# EAGLE design googleShoes_rev05 (EAGLE 6.2)
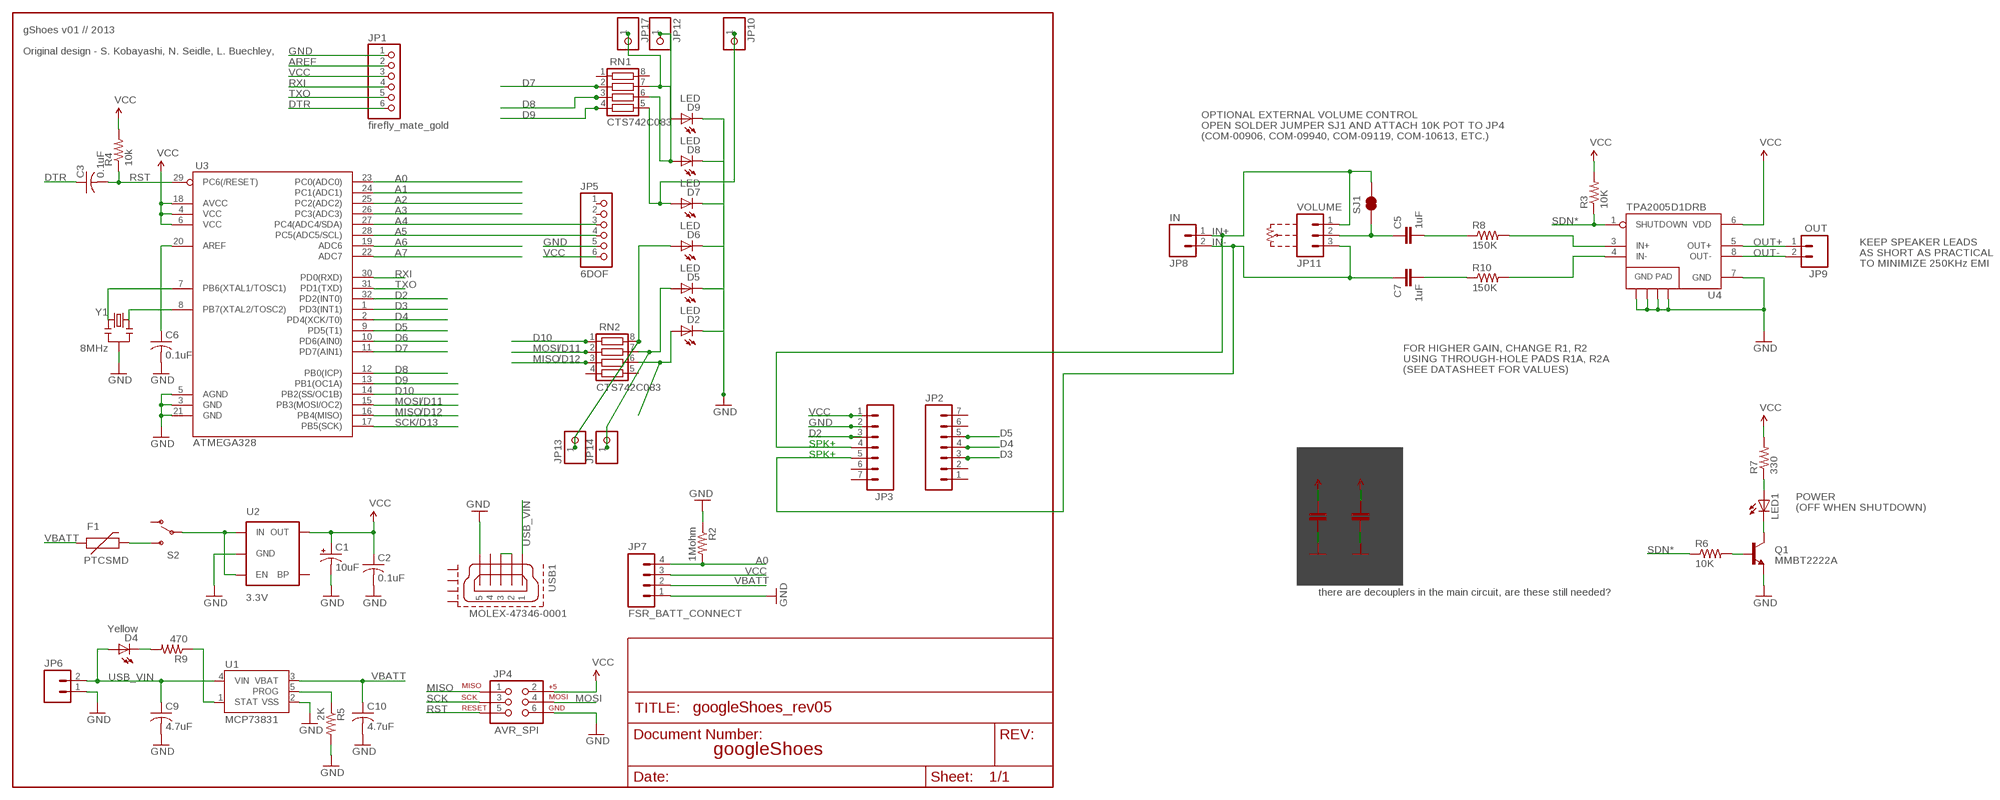
[diagram p0: schematic, sheet 1]

## Parts
C1  10uF  CAP_POL1206  [EIA3216]
C2  0.1uF  C-USC0805  [C0805]
C3  0.1uF  C-USC0805  [C0805]
C4  1uF  CAP1206  [1206]
C5  1uF  CAP1206  [1206]
C6  0.1uF  C-USC0805  [C0805]
C7  1uF  CAP1206  [1206]
C8  10uF  CAP1206  [1206]
C9  4.7uF  C-USC0805  [C0805]
C10  4.7uF  C-USC0805  [C0805]
D2  LED  LEDCHIP-LED0805  [CHIP-LED0805]
D4  Yellow  LEDCHIP-LED0805  [CHIP-LED0805]
D5  LED  LEDCHIP-LED0805  [CHIP-LED0805]
D6  LED  LEDCHIP-LED0805  [CHIP-LED0805]
D7  LED  LEDCHIP-LED0805  [CHIP-LED0805]
D8  LED  LEDCHIP-LED0805  [CHIP-LED0805]
D9  LED  LEDCHIP-LED0805  [CHIP-LED0805]
F1  PTCSMD  [PTC-1206]
JP1  firefly_mate_gold  PINHD-1X6B  [1X06-BIG]
JP2  M07  [1X07]
JP3  M07  [1X07]
JP4  AVR_SPI  AVR_SPI_PRG_6PTH  [2X3]
JP5  6DOF  PINHD-1X6B  [1X06-BIG]
JP6  M02PTH  [1X02]
JP7  FSR_BATT_CONNECT  M04PTH  [1X04]
JP8  IN  M02PTH  [1X02]
JP9  OUT  M02PTH  [1X02]
JP10  PINHD-1X1CB  [1X01-CLEANBIG]
JP11  VOLUME  M03PTH  [1X03]
JP12  PINHD-1X1CB  [1X01-CLEANBIG]
JP13  PINHD-1X1CB  [1X01-CLEANBIG]
JP14  PINHD-1X1CB  [1X01-CLEANBIG]
JP17  PINHD-1X1CB  [1X01-CLEANBIG]
LED1  LEDCHIPLED_0805  [CHIPLED_0805]
Q1  MMBT2222A  TRANSISTOR_NPNSOT23-3  [SOT23-3]
R2  1Mohm  R-US_M0805  [M0805]
R3  10K  R-US_M0805  [M0805]
R4  10k  R-US_M0805  [M0805]
R5  2K  R-US_M0805  [M0805]
R6  10K  R-US_M0805  [M0805]
R7  330  R-US_M0805  [M0805]
R8  150K  R-US_M0805  [M0805]
R9  470  R-US_M0805  [M0805]
R10  150K  R-US_M0805  [M0805]
RN1  CTS742C083  [CTS742C083]
RN2  CTS742C083  [CTS742C083]
S2  SWITCH-SPSTSMD  [AYZ0202]
SJ1  SOLDERJUMPERNC2  [SJ_2S-NOTRACE]
U1  MCP73831  MCP73831SMD  [SOT23-5]
U2  3.3V  V_REG_LDOSMD  [SOT23-5]
U3  ATMEGA328  ATMEGA168  [TQFP32-08]
U4  TPA2005D1DRB  [QFN-8_PAD]
USB1  MOLEX-47346-0001  [MOLEX-47364-0001]
Y1  8MHz  RESONATORSMD  [RESONATOR-SMD]

## Nets
A0: JP7.4 R2.2 U3.23(PC0(ADC0))
A1: U3.24(PC1(ADC1))
A2: U3.25(PC2(ADC2))
A3: U3.26(PC3(ADC3))
A4: JP5.3 U3.27(PC4(ADC4/SDA))
A5: JP5.4 U3.28(PC5(ADC5/SCL))
A6: U3.19(ADC6)
A7: U3.22(ADC7)
AREF: C6.1 JP1.2 U3.20(AREF)
D2: JP3.3 U3.32(PD2(INT0))
D3: JP2.3 U3.1(PD3(INT1))
D4: JP2.4 U3.2(PD4(XCK/T0))
D5: JP2.5 U3.9(PD5(T1))
D6: U3.10(PD6(AIN0))
D7: RN1.2 U3.11(PD7(AIN1))
D8: RN1.3 U3.12(PB0(ICP))
D9: RN1.4 U3.13(PB1(OC1A))
D10: RN2.1 U3.14(PB2(SS/OC1B))
DTR: C3.1 JP1.6
GND: C1.C(-) C2.2 C4.2 C6.2 C8.2 C9.2 C10.2 D2.C D5.C D6.C D7.C D8.C D9.C JP1.1 JP3.2 JP4.6 JP5.5 JP6.1 JP7.1 Q1.2(E) R2.1 R5.2 U1.2(VSS) U2.2(GND) U3.3(GND) U3.5(AGND) U3.21(GND) U4.7(GND) U4.10(GND) U4.11(GND) U4.12(GND) U4.13(GND) USB1.5 Y1.2
IN+: JP3.4 JP8.1 JP11.1 SJ1.2
IN+AMP: R8.2 U4.3(IN+)
IN-: C7.1 JP3.5 JP8.2 JP11.3
IN-AMP: R10.2 U4.4(IN-)
MISO: JP4.1 RN2.3 U3.16(PB4(MISO))
MOSI: JP4.4 RN2.2 U3.15(PB3(MOSI/OC2))
N$1: C5.1 JP11.2 SJ1.1
N$2: D5.A JP14.1 RN2.7
N$4: D2.A RN2.6
N$5: S2.2(P) U2.1(IN) U2.3(EN)
N$7: D6.A JP13.1 RN2.8
N$8: D4.C R9.2
N$9: F1.2 S2.3(S)
N$10: U3.7(PB6(XTAL1/TOSC1)) Y1.3
N$11: R5.1 U1.5(PROG)
N$12: U3.8(PB7(XTAL2/TOSC2)) Y1.1
N$14: R9.1 U1.1(STAT)
N$15: D9.A JP17.1 RN1.7
N$16: D8.A JP12.1 RN1.6
N$17: D7.A JP10.1 RN1.5
N$18: LED1.A R7.1
N$19: Q1.1(B) R6.2
N$20: LED1.C Q1.3(C)
N$21: C5.2 R8.1
N$22: C7.2 R10.1
N$23: USB1.2 USB1.3
OUT+: JP9.1 U4.5(OUT+)
OUT-: JP9.2 U4.8(OUT-)
RST: C3.2 JP4.5 R4.1 U3.29(PC6(/RESET))
RXI: JP1.4 U3.30(PD0(RXD))
SCK: JP4.3 U3.17(PB5(SCK))
SDN*: R3.1 R6.1 U4.1(SHUTDOWN)
TXO: JP1.5 U3.31(PD1(TXD))
USB_VIN: C9.1 D4.A JP6.2 U1.4(VIN) USB1.1
VBATT: C10.1 F1.1 JP7.2 U1.3(VBAT)
VCC [VCC]: C1.A(+) C2.1 C4.1 C8.1 JP1.3 JP3.1 JP4.2 JP5.6 JP7.3 R3.2 R4.2 R7.2 U2.5(OUT) U3.4(VCC) U3.6(VCC) U3.18(AVCC) U4.6(VDD)
Unconnected: JP2.1 JP2.2 JP2.6 JP2.7 JP3.6 JP3.7 JP5.1 JP5.2 RN1.1 RN1.8 RN2.4 RN2.5 S2.1(O) U2.4(BP) USB1.4 USB1.GND1 USB1.GND2 USB1.GND3 USB1.GND4

## Notes on the sheet
- gShoes v01 // 2013
- Original design - S. Kobayashi, N. Seidle, L. Buechley,
- OPTIONAL EXTERNAL VOLUME CONTROL
- OPEN SOLDER JUMPER SJ1 AND ATTACH 10K POT TO JP4
- (COM-00906, COM-09940, COM-09119, COM-10613, ETC.)
- KEEP SPEAKER LEADS
- AS SHORT AS PRACTICAL
- TO MINIMIZE 250KHz EMI
- /D11 | FOR HIGHER GAIN, CHANGE R1, R2
- /D12 | USING THROUGH-HOLE PADS R1A, R2A
- (SEE DATASHEET FOR VALUES)
- /D11
- /D12
- /D13
- SPK+
- SPK+
- POWER
- (OFF WHEN SHUTDOWN)
- there are decouplers in the main circuit, are these still needed?
- googleShoes

## Library data of the parts
C1 = SparkFun:CAP_POL: Capacitor Polarized These are standard SMD and PTH capacitors. Normally 10uF, 47uF, and 100uF in electrolytic and tantalum varieties. Always verify the external diameter of the through hole cap, it varies with capacity, voltage, and manufacturer. The EIA devices should be standard.
C2 C3 C6 C9 C10 = adafruit:C-US: CAPACITOR, American symbol
C4 C5 C7 C8 = SparkFun:CAP: Capacitor Standard 0603 ceramic capacitor, and 0.1" leaded capacitor.
D2 D4-D9 = adafruit:LED: LED
F1 = SparkFun:PTC: Resettable Fuse PTC Resettable Fuse. Spark Fun Electronics SKU : COM-08357
JP1 JP5 = adafruit:PINHD-1X6: PIN HEADER
JP2 JP3 = SparkFun-Connectors:M07: Header 7 Standard 7-pin 0.1" header. Use with straight break away headers (SKU : PRT-00116), right angle break away headers (PRT-00553), swiss pins (PRT-00743), machine pins (PRT-00117), and female headers (PRT-00115). NOTES ON THE VARIANTS LOCK and LOCK_LONGPADS... This footprint was designed to help hold the alignment of a through-hole component (i.e. 7-pin header) while soldering it into place. You may notice that each hole has been shifted either up or down by 0.005 of an inch from it's more standard position (which is usually a perfectly straight line). This slight alteration caused the pins (the squares in the middle) to touch the edges of the holes. Because they are alternating, it causes a "brace" to hold the header in place. 0.005 has proven to be the perfect amount of "off-center" position when using our standard breakaway headers. Although looks a little odd when you look at the bare footprint, once you have a header in there, the alteration is very hard to notice. Also, if you push a header all the way into place, it is covered up entirely on the bottom side. This idea of altering the position of holes to aid alignment will be further integrated into the Sparkfun Library for other footprints. It can help hold any component with 3 or more connection pins.
JP4 = SparkFun:AVR_SPI_PRG_6: AVR ISP 6 Pin This is the reduced ISP connector for AVR programming. Common on Arduino. This footprint will take up less PCB space and can be used with a 10-pin to 6-pin adapter such as SKU: BOB-08508
JP6 JP8 JP9 = SparkFun:M02: Header 2 Standard 2-pin 0.1" header. Use with straight break away headers (SKU : PRT-00116), right angle break away headers (PRT-00553), swiss pins (PRT-00743), machine pins (PRT-00117), and female headers (PRT-00115). Molex polarized connector foot print use with SKU : PRT-08233 with associated crimp pins and housings.
JP7 = SparkFun-Connectors:M04: Header 4 Standard 4-pin 0.1" header. Use with straight break away headers (SKU : PRT-00116), right angle break away headers (PRT-00553), swiss pins (PRT-00743), machine pins (PRT-00117), and female headers (PRT-00115). Molex polarized connector foot print use with SKU : PRT-08231 with associated crimp pins and housings. 1MM SMD Version SKU: PRT-10208
JP10 JP12-JP14 JP17 = adafruit:PINHD-1X1: Pin header 1x1 for 0.1" spacing With round pins
JP11 = SparkFun:M03: Header 3 Standard 3-pin 0.1" header. Use with straight break away headers (SKU : PRT-00116), right angle break away headers (PRT-00553), swiss pins (PRT-00743), machine pins (PRT-00117), and female headers (PRT-00115). Molex polarized connector foot print use with SKU : PRT-08232 with associated crimp pins and housings.
LED1 = led:LED: LED
Q1 = SparkFun:TRANSISTOR_NPN: Transistor NPN BJT configuration in SOT23 package. MMBT2222 is the common NPN we use. Double check BCE configuration again layout.
R2 R4 R5 R9 = rcl:R-US_: RESISTOR, American symbol
R3 R6-R8 R10 = resistor:R-US_: RESISTOR, American symbol
RN1 RN2 = resistor-net:CTS742C083: Chip Resistor Array 4 Single Resistor Source: http://www.ctscorp.com/components/Datasheets/CTSChipArrayDs.pdf; OC_FARNELL: unknown; OC_NEWARK: unknown
S2 = SparkFun:SWITCH-SPST: SPST Switch Simple slide switch. Spark Fun Electronics SKU : COM-00102
SJ1 = SparkFun:SOLDERJUMPER: Solder Jumper Standard SMD solder jumper. Used to automate production. Two varients : Normally Open and Normally Closed are the same, but have different paste layers. NC will have a large amount of paste and should jumper during reflow.
U1 = SparkFun:MCP73831
U2 = SparkFun:V_REG_LDO: Voltage Regulator LDO Standard 150mA LDO voltage regulator in SOT-23 layout. Micrel part MIC5205. BP (by-pass) pin is used to lower output noise with 470pF cap.
U3 = SparkFun:ATMEGA168
U4 = mike-temp:TPA2005D1: 1.4W MONO CLASS-D AUDIO POWER AMPLIFIER The TPA2005D1 is a 1.4-W high efficiency filter-free class-D audio power amplifier in a BGA, QFN, or MSOP package that requires only three external components. Datasheet: http://focus.ti.com/lit/ds/symlink/tpa2005d1.pdf 1.4 W Into 8 ? From a 5V Supply at THD = 10% (Typ) Maximum Battery Life and Minimum Heat Efficiency With an 8-? Speaker: 84% at 400 mW, 79% at 100 mW 2.8-mA Quiescent Current 0.5-mA Shutdown Current Ideal for Wireless or Cellular Handsets and PDAs Capable of Driving an 8-? Speaker (2.5 V ? VDD ? 5.5 V) and a 4-? Speaker (2.5 V ? VDD ? 4.2 V) Only Three External Components Optimized PWM Output Stage Eliminates LC Output Filter Internally Generated 250-kHz Switching Frequency Eliminates Capacitor and Resistor Improved PSRR (-71 dB at 217 Hz) and Wide Supply Voltage (2.5 V to 5.5 V) Eliminates Need for a Voltage Regulator Fully Differential Design Reduces RF Rectification and Eliminates Bypass Capacitor Improved CMRR Eliminates Two Input Coupling Capacitors
USB1 = usb_con-update:MOLEX-47346-0001: MICRO USB B, BOTTOM MOUNT
Y1 = SparkFun:RESONATOR: Resonator Small SMD resonator. This is the itty bitty 10/20MHz resonators with built in caps. CSTCE10M0G55 and CSTCE20M0V53. Footprint has been reviewed closely but hasn't been tested yet.

## Net classes
0 Default: width 0.203 mm
1 VCC: width 0.381 mm
2 LEDPower: width 0.203 mm
3 ButtonSignal: width 0.203 mm

## Board
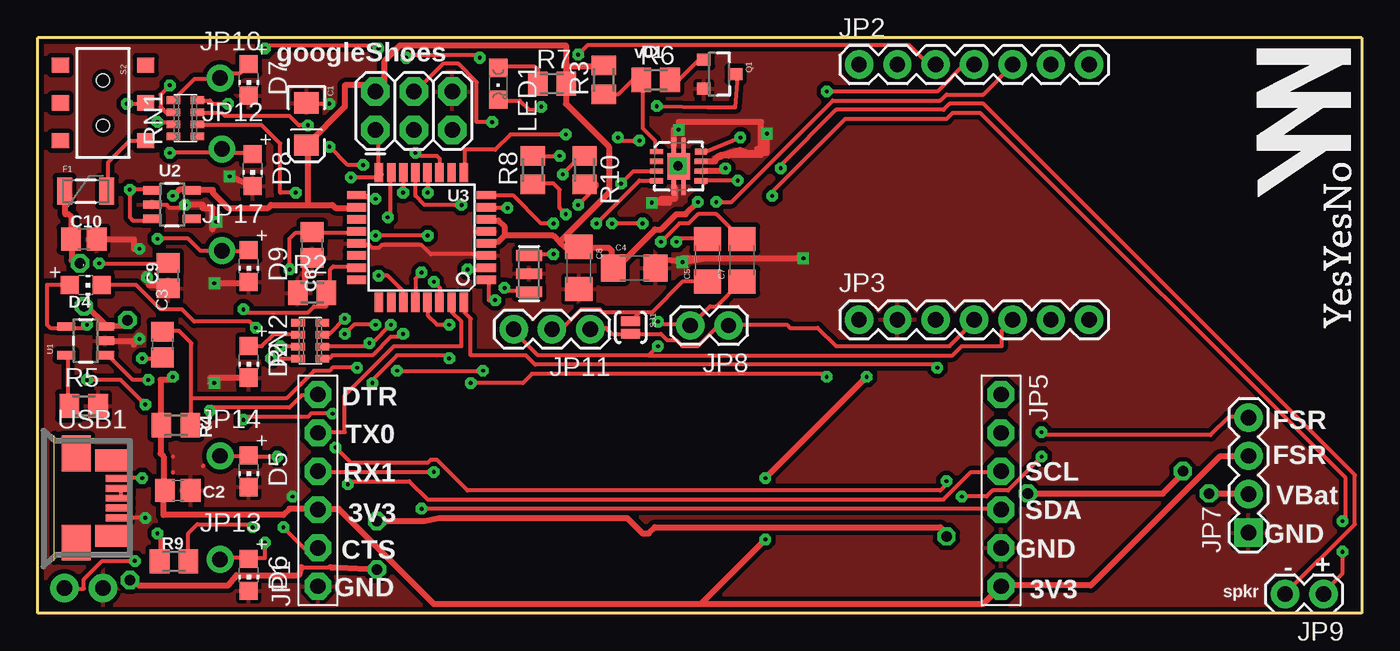
[diagram p1: board, top side]
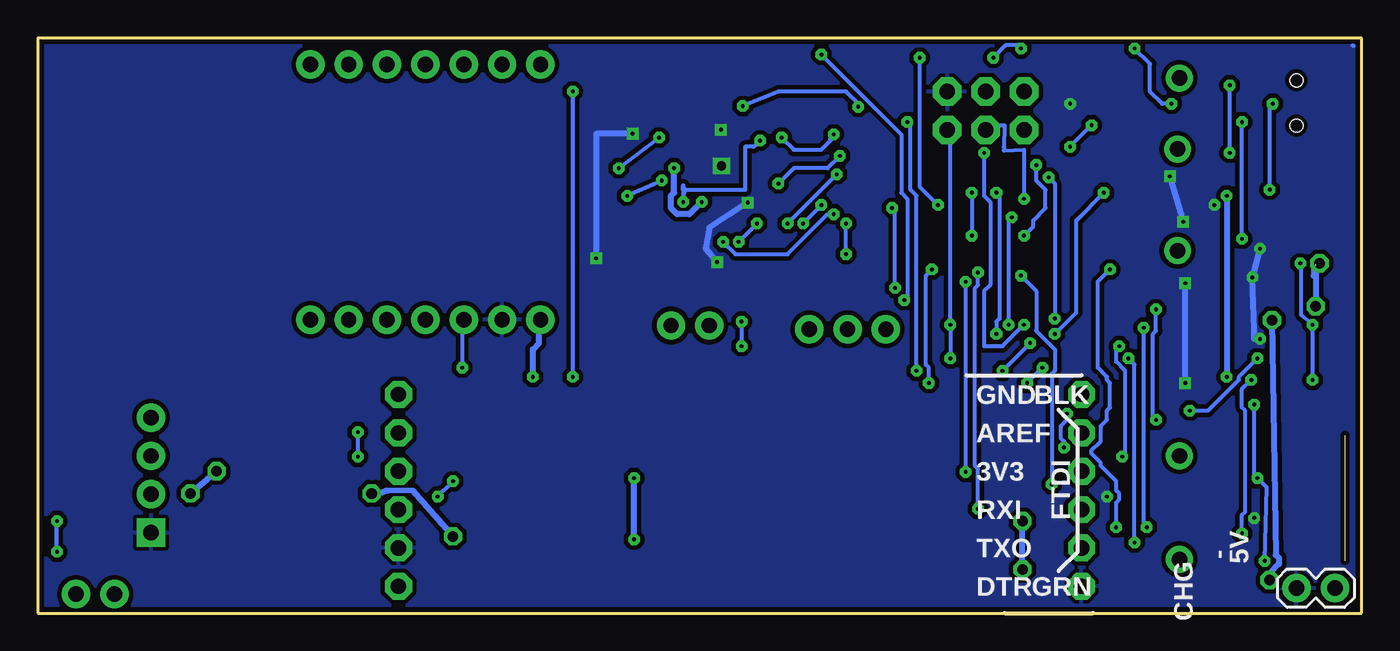
[diagram p2: board, bottom side, seen from below]

Size 87.63 x 38.1 mm. Coordinates in mm from the lower left corner, seen from the top.
Outline: 87.63,38.1 87.63,0 0,0 0,38.1 87.63,38.1
Copper layers (1*16): Top 0.035mm / dielectric 1.5mm / Bottom 0.035mm
Design rules: minimum track width 10mil, minimum drill 10mil, track to track 8mil, track to pad 8mil, pad to pad 8mil, via to via 4mil, smd to smd 8mil, copper to edge 8mil, drill to drill 8mil, minimum pad ring 12mil, minimum via ring 10mil, stop-mask expansion 4mil, vias tented up to drill 20mil, thermal gap 10mil

### Footprints (pad centres in the part's own frame; a part is rotated, then mirrored left to right if it is on the bottom)
EIA3216 = smd 1.4 x 1.6: A 1.4,0; C -1.4,0
C0805 = smd 1.3 x 1.5: 1 -0.85,0; 2 0.85,0
1206 = smd 1.6 x 1.8: 1 -1.4,0; 2 1.4,0
CHIP-LED0805 = smd 1.2 x 1.2: A 0,-1.05; C 0,1.05
PTC-1206 = smd 1 x 1.8: 1 -1.4,0; 2 1.4,0
1X06-BIG = drill 1.016 pad 1.778 octagon: 1 -6.35,0; 2 -3.81,0; 3 -1.27,0; 4 1.27,0; 5 3.81,0; 6 6.35,0
1X07 = drill 1.016 pad 1.88: 1 0,0; 2 2.54,0; 3 5.08,0; 4 7.62,0; 5 10.16,0; 6 12.7,0; 7 15.24,0
2X3 = drill 1.016 pad 1.88 octagon: 1 0,0; 2 0,2.54; 3 2.54,0; 4 2.54,2.54; 5 5.08,0; 6 5.08,2.54
1X02 = drill 1.016 pad 1.88: 1 0,0; 2 2.54,0
1X04 = drill 1.016 pad 1.88 square: 1 0,0 | drill 1.016 pad 1.88: 2 2.54,0; 3 5.08,0; 4 7.62,0
1X01-CLEANBIG = drill 1.016 pad 1.778: 1 0,0
1X03 = drill 1.016 pad 1.88: 1 0,0; 2 2.54,0; 3 5.08,0
CHIPLED_0805 = smd 1.2 x 1.2: A 0,-1.05; C 0,1.05
SOT23-3 = smd 0.8 x 0.9: 1 -0.95,-1; 2 0.95,-1; 3 0,1.1
M0805 = smd 1.3 x 1.6: 1 -0.95,0; 2 0.95,0
CTS742C083 = smd 0.5 x 0.9: 1 -1.2,-0.8; 2 -0.4,-0.8; 3 0.4,-0.8; 4 1.2,-0.8; 5 1.2,0.8; 6 0.4,0.8; 7 -0.4,0.8; 8 -1.2,0.8
AYZ0202 = smd 1 x 1.15: 1 -2.5,2.825; 2 0,2.825; 3 2.5,2.825; 4 -2.5,-2.825; 5 0,-2.825; 6 2.5,-2.825 | hole 0.85: 1.5,0; -1.5,0
SJ_2S-NOTRACE = smd 0.635 x 1.27: 1 -0.401,0; 2 0.413,0
SOT23-5 = smd 0.55 x 1.2: 1 -0.95,-1.3; 2 0,-1.3; 3 0.95,-1.3; 4 0.95,1.3; 5 -0.95,1.3
TQFP32-08 = smd 1.27 x 0.559: 1 -4.293,2.8; 2 -4.293,2; 3 -4.293,1.2; 4 -4.293,0.4; 5 -4.293,-0.4; 6 -4.293,-1.2; 7 -4.293,-2; 8 -4.293,-2.8; 17 4.293,-2.8; 18 4.293,-2; 19 4.293,-1.2; 20 4.293,-0.4; 21 4.293,0.4; 22 4.293,1.2; 23 4.293,2; 24 4.293,2.8 | smd 0.559 x 1.27: 9 -2.8,-4.293; 10 -2,-4.293; 11 -1.2,-4.293; 12 -0.4,-4.293; 13 0.4,-4.293; 14 1.2,-4.293; 15 2,-4.293; 16 2.8,-4.293; 25 2.8,4.293; 26 2,4.293; 27 1.2,4.293; 28 0.4,4.293; 29 -0.4,4.293; 30 -1.2,4.293; 31 -2,4.293; 32 -2.8,4.293
QFN-8_PAD = smd 0.35 x 0.85: 1 -0.975,-1.475; 2 -0.325,-1.475; 3 0.325,-1.475; 4 0.975,-1.475; 5 0.975,1.475; 6 0.325,1.475; 7 -0.325,1.475; 8 -0.975,1.475 | smd 1.75 x 1.5: 9 0,0 | smd 1.025 x 0.28: 10 -1.387,-0.325; 11 1.387,-0.325; 12 1.387,0.325; 13 -1.387,0.325
MOLEX-47364-0001 = smd 1.7 x 0.45: 1 2.8,1.3; 2 2.8,0.65; 3 2.8,0; 4 2.8,-0.65; 5 2.8,-1.3 | smd 1.9 x 2.375: GND1 0,2.95; GND4 0,-2.95 | smd 2.1 x 1.475: GND2 2.3,2.5; GND3 2.3,-2.5
RESONATOR-SMD = smd 0.7 x 1.7: 1 -1.2,0; 2 0,0; 3 1.2,0

### Placement (x,y rotation side)
C1  17.78,32.38 270 top
C2  9.27,8.13 0 top
C3  8.26,17.78 90 top
C4  39.5,22.86 0 top
C5  44.32,23.37 90 top
C6  18.16,24.38 270 top
C7  46.61,23.37 90 top
C8  35.81,22.86 270 top
C9  8.64,22.35 270 top
C10  3.05,24.77 0 top
D2  13.97,16.64 180 top
D4  3.17,21.72 270 top
D5  13.97,9.4 180 top
D6  13.97,2.54 180 top
D7  13.97,35.31 180 top
D8  14.22,29.34 180 top
D9  13.97,22.99 180 top
F1  3.17,27.94 0 top
JP1  18.54,8.13 90 top
JP2  54.36,36.32 0 top
JP3  54.36,19.43 0 top
JP4  22.35,32 0 top
JP5  63.75,8.13 270 top
JP6  4.32,1.65 0 bottom
JP7  80.14,5.33 90 top
JP8  45.72,19.05 180 top
JP9  85.09,1.27 180 top
JP10  12.06,35.43 0 top
JP11  36.58,18.8 180 top
JP12  12.19,30.73 0 top
JP13  12.06,3.56 0 top
JP14  12.06,10.41 0 top
JP17  12.19,24 0 top
LED1  30.48,35.05 180 top
Q1  45.09,35.69 270 top
R2  18.16,21.21 0 top
R3  37.47,35.31 90 top
R4  9.14,12.45 180 top
R5  3.05,13.72 0 top
R6  40.89,35.31 0 top
R7  34.04,35.05 0 top
R8  32.77,29.34 90 top
R9  9.02,3.43 0 top
R10  36.2,29.34 270 top
RN1  9.78,32.77 90 top
RN2  18.03,18.03 90 top
S2  4.32,33.78 270 top
SJ1  39.24,18.92 270 top
U1  3.17,18.03 90 top
U2  8.89,27.05 270 top
U3  25.39,24.88 180 top
U4  42.42,29.59 270 top
USB1  2.54,7.62 0 top
Y1  32.51,22.48 270 top

### Tracks (layer width: path | path; a pad name or v marks a point on that pad's centre or on a via)
A0  (via drill 0.25)
  Top 0.254: U3.23 20.93,22.96 19.56,22.96 19.36,22.76 19.36,21.08 R2.2 19.1,21.13 19.1,20.32 18.29,20.32 17.88,19.91 13.82,19.91 v13.61,20.12 | v13.61,12.8 13.82,13.01 17.88,13.01 18.09,13.21 v19.51,13.21 | v19.71,10.97 20.73,9.96 25.81,9.96 26.01,10.16 26.42,10.16 28.45,8.13 59.74,8.13 60.15,8.53 v60.15,8.74 | v61.16,7.72 62.79,7.72 63.2,8.13 64.21,8.13 v66.45,10.36 | v66.45,11.99 66.45,11.79 77.62,11.79 78.84,13.01 80.06,13.01 JP7.4
  Bottom 0.254: v13.61,20.12 13.61,18.69 13.82,18.49 13.82,13.01 v13.61,12.8 | v19.51,13.21 19.51,12.8 19.91,12.39 19.91,11.58 19.71,11.38 v19.71,10.97 | v61.16,7.72 v60.15,8.74 | v66.45,11.99 v66.45,10.36
A4  (via drill 0.25)
  Top 0.254: v20.52,8.53 20.73,8.74 24.59,8.74 25.81,7.52 59.94,7.52 61.77,9.35 63.6,9.35 JP5.3 | v22.55,22.35 23.16,22.35 24.18,21.34 24.18,20.73 U3.27
  Bottom 0.254: v20.52,8.53 20.52,15.85 20.32,16.05 20.32,17.48 21.54,18.69 21.54,21.34 v22.55,22.35
A5  (via drill 0.25)
  Top 0.254: v25.4,22.55 24.99,22.15 24.99,20.73 U3.28 | v25.4,6.91 63.6,6.91 JP5.4
  Bottom 0.254: v25.4,22.55 25.4,21.74 25.6,21.54 25.6,9.75 25.4,9.55 v25.4,6.91
AREF  (via drill 0.25)
  Top 0.254: U3.20 20.93,25.2 18.29,25.2 C6.1 18.09,25.2 17.07,25.2 16.66,24.79 v16.66,22.76 | v16.26,5.69 17.68,4.27 18.49,4.27 JP1.2
  Bottom 0.254: v16.66,22.76 17.48,21.95 17.48,16.26 16.87,15.65 16.87,15.44 16.66,15.24 16.66,13.61 16.87,13.41 16.87,12.8 17.27,12.39 17.27,11.38 17.88,10.77 17.88,10.57 17.27,9.96 17.27,9.75 16.26,8.74 16.26,8.13 16.05,7.92 16.05,7.52 16.26,7.32 v16.26,5.69
D2  (via drill 0.25)
  Top 0.254: v59.54,16.26 59.33,16.46 32.92,16.46 32.31,17.07 28.65,17.07 28.65,19.51 28.25,19.91 28.25,20.52 U3.32
  Bottom 0.254: v59.54,16.26 59.54,19.3 JP3.3
D3  (via drill 0.25)
  Top 0.254: v30.28,20.73 29.87,20.73 29.87,21.95 U3.1 | v35.76,36.98 36.37,37.59 57.71,37.59 58.93,36.37 59.33,36.37 JP2.3
  Bottom 0.254: v30.28,20.73 30.07,20.93 30.07,27.43 30.48,27.84 30.48,31.7 v35.76,36.98
D4  (via drill 0.25)
  Top 0.254: v28.45,22.76 29.67,22.76 U3.2 | v28.65,15.24 32.11,15.24 32.72,15.85 52.02,15.85 v52.22,15.65 | v52.22,34.54 59.54,34.54 61.37,36.37 61.98,36.37 JP2.4
  Bottom 0.254: v28.45,22.76 28.85,22.35 28.85,16.46 28.65,16.26 v28.65,15.24 | v52.22,34.54 v52.22,15.65
D5  (via drill 0.25)
  Top 0.254: v34.95,31.7 31.29,31.7 30.28,30.68 28.25,30.68 28.25,29.26 U3.9 | v44.91,27.23 45.92,27.23 52.63,33.93 59.74,33.93 60.15,34.34 62.59,34.34 64.41,36.17 JP2.5 | v39.83,31.29 38.61,31.29 v38.41,31.5
  Bottom 0.254: v34.95,31.7 35.15,31.5 35.15,31.29 35.76,30.68 37.59,30.68 v38.41,31.5 | 40.81,30.89 | 40.81,30.89 40.81,28.03 44.92,28.03 44.92,28.32 44.86,27.74 44.83,28.14 44.89,28.14 44.89,28.2 44.92,28.2 44.92,28.05 v44.91,27.23 | 40.81,30.89 40.23,30.89 v39.83,31.29
D7  (via drill 0.25)
  Top 0.254: v17.07,27.84 16.05,27.84 16.05,31.09 14.83,32.31 10.77,32.31 RN1.2 | v20.32,18.49 20.93,19.1 v22.35,19.1 | v24.99,30.48 25.2,30.28 26.42,30.28 26.62,30.07 26.62,29.26 U3.11
  Bottom 0.254: v17.07,27.84 18.9,26.01 18.9,19.91 v20.32,18.49 | v22.35,19.1 23.77,17.68 24.99,17.68 24.99,21.34 24.59,21.74 24.59,27.23 24.99,27.64 v24.99,30.48
D8  (via drill 0.25)
  Top 0.254: v17.88,32.31 17.27,32.31 16.66,32.92 12.39,32.92 12.19,33.12 10.77,33.12 RN1.3 | v19.3,30.89 20.52,29.67 v21.54,29.67 | v25.81,24.99 v22.35,24.99 | v25.81,27.84 25.81,29.06 U3.12
  Bottom 0.254: v19.3,30.89 v17.88,32.31 | v21.54,29.67 21.54,28.65 20.93,28.04 20.93,26.82 21.74,26.01 21.74,25.6 v22.35,24.99 | v25.81,27.84 v25.81,24.99
D9  (via drill 0.25)
  Top 0.254: v28.04,27.03 25.6,27.03 24.99,27.64 24.99,29.06 U3.13 | v29.26,36.78 29.06,36.98 24.59,36.98 v24.38,36.78 | v22.55,37.39 22.35,37.59 15.24,37.59 v15.04,37.39 | v12.6,33.73 11.58,33.73 11.38,33.93 10.77,33.93 RN1.4
  Bottom 0.254: v28.04,27.03 29.26,28.25 v29.26,36.78 | v24.38,36.78 23.57,37.59 22.76,37.59 v22.55,37.39 | v15.04,37.39 14.02,36.37 14.02,34.54 13.21,33.73 v12.6,33.73
D10  (via drill 0.25)
  Top 0.254: v24.18,18.49 23.98,18.29 23.37,18.29 22.15,17.07 19.51,17.07 19.3,16.87 18.9,16.87 RN2.1 | v24.18,27.84 24.18,29.06 U3.14
  Bottom 0.254: v24.18,18.49 24.18,19.3 23.98,19.51 23.98,27.64 v24.18,27.84
DTR  (via drill 0.25)
  Top 0.254: v6.91,16.87 8.13,16.87 C3.1 | v11.38,13.41 11.58,13.61 16.66,13.61 17.48,14.43 18.49,14.43 JP1.6
  Bottom 0.254: v6.91,16.87 8.13,15.65 8.13,15.44 10.16,13.41 v11.38,13.41
GND  (via drill 0.25, 0.6)
  Top 0.254: v7.11,6.3 5.49,6.3 USB1.5 | U3.21 21.13,24.38 21.95,24.38 22.15,24.18 22.55,24.18 22.76,24.38 25.4,24.38 26.01,23.77 29.67,23.77 U3.3 | D5.C 14.02,8.33 14.02,8.22 | 10.97,9.75 10.92,9.73 | 8.94,10.36 8.95,10.36 | 8.94,9.35 8.95,9.31 | v19.3,33.73 17.88,33.73 C1.C | v9.75,27.03 9.55,26.82 8.74,26.82 8.53,27.03 7.72,27.03 U2.2 | 44.7,29.84 45.21,30.23 45.72,30.23 | 11.18,12.6
  Top 0.406: C6.2 17.65,23.53 17.65,21.59 17.21,21.59 R2.1 | U1.2 6.35,18.03 6.35,17.78 v6.73,18.16 | v7.24,22.23 7.11,22.48 7.37,21.72 8.64,21.72 C9.2 | C10.2 6.35,24.77 6.35,24.13 v6.73,24.13 | D2.C 11.43,15.59 11.43,15.24 v11.68,15.24 | v11.68,21.84 13.97,21.84 D9.C | D8.C v12.7,28.92 | v11.81,25.91 11.56,25.4 11.56,26.8 10.92,26.8 10.92,27.05 9.75,27.05 v9.75,27.03 | U4.11 42.16,28.2 42.16,27.43 41.27,27.43 41.27,27.18 | 41.27,27.18 41.78,27.18 | 41.27,27.18 v40.64,27.18 | v42.67,23.24 44.07,23.5 | v42.67,23.24 40.9,23.5 C4.2 | U4.10 42.09,32 v42.42,32 42.42,32.51 47.88,32.51 47.88,30.73 47.62,30.73 47.88,30.35 45.21,30.35 44.96,30.1 44.83,30.1 44.83,29.92 U4.7 44.7,29.92 44.96,30.23 | 45.21,30.23 44.96,30.23 | 44.96,30.23 46.48,30.68 46.99,30.48 48.26,30.48 v48.26,31.75 | v50.67,23.5 42.67,23.5 v42.67,23.24
  Bottom 0.254: 0.61,37.59 0.53,37.57
  Bottom 0.406: v6.73,18.16 7.11,18.16 7.11,18.8 v7.24,22.23 v6.73,24.13 | v11.68,15.24 v11.68,21.84 | v12.7,28.92 v11.81,25.91 | v40.64,27.18 43.18,25.53 43.43,24.13 v42.67,23.24 | v48.26,31.75 50.67,31.75 v50.67,23.5
  other vias: 16.87,7.72 42.37,29.62
  pour Top (isolate 0.305): 0,0 0,38.1 87.63,38.1 87.63,0
  pour Bottom (isolate 0.305): 0,0 0,38.1 87.63,38.1 87.63,0
IN+
  Top 0.254: JP11.1 36.58,18.9 37.59,18.9 38,18.49 39.22,18.49 SJ1.2 39.42,18.49 41.25,18.49 41.66,18.09 42.27,18.09 42.67,17.68 43.69,17.68 45.11,19.1 45.72,19.1 | 45.72,19.1 49.58,19.1 49.78,18.9 51.61,18.9 52.83,17.68 60.35,17.68 61.98,19.3 JP3.4 | 45.72,19.1 JP8.1
IN+AMP  (via drill 0.25)
  Top 0.254: v38.61,28.45 39.42,29.26 40.84,29.26 U4.3 | v34.54,30.28 32.92,30.28 R8.2
  Bottom 0.254: v38.61,28.45 37.59,29.46 35.36,29.46 v34.54,30.28
IN-  (via drill 0.25)
  Top 0.254: 40.44,17.07 33.12,17.07 31.5,18.69 JP11.3 | v41.05,17.68 40.44,17.07 | v41.05,19.3 41.25,19.1 43.08,19.1 JP8.2 43.28,19.1 44.5,20.32 44.91,20.32 46.53,21.95 C7.1 | 40.44,17.07 60.55,17.07 61.16,17.68 63.8,17.68 63.8,18.69 64.41,19.3 JP3.5
  Bottom 0.254: v41.05,19.3 v41.05,17.68
IN-AMP  (via drill 0.25)
  Top 0.254: v36.98,25.81 39.83,28.65 40.84,28.65 U4.4 | v35.76,27.03 36.98,28.25 36.98,28.45 36.58,28.45 36.37,28.25 R10.2
  Bottom 0.254: v35.76,27.03 v36.98,25.81
MISO  (via drill 0.25)
  Top 0.254: v20.32,19.51 19.3,18.49 18.9,18.49 RN2.3 | v20.73,28.85 22.55,28.85 22.76,29.06 U3.16 22.55,29.26 22.55,31.09 22.35,31.29 JP4.1 22.35,32.31
  Bottom 0.254: v20.32,19.51 20.32,28.45 v20.73,28.85
MOSI  (via drill 0.25)
  Top 0.254: v30.07,32.51 29.06,32.51 29.06,35.15 27.84,36.37 26.82,36.37 25.4,34.95 24.79,34.95 JP4.4 | v23.77,16.05 v29.46,16.05 | RN2.2 18.9,17.68 21.95,17.68 v21.95,17.88 22.15,17.88 v23.37,19.1 | v23.16,26.21 23.37,26.42 23.37,29.06 U3.15
  Bottom 0.254: v30.07,32.51 29.87,32.31 29.87,28.04 29.46,27.64 v29.46,16.05 | v21.95,17.88 v23.77,16.05 | v23.16,26.21 23.37,26.01 v23.37,19.1
N$1
  Top 0.254: 39.83,19.91 39.42,19.51 SJ1.1 | 39.83,19.91 40.64,19.91 42.67,21.95 44.3,21.95 C5.1 | 39.83,19.91 37.39,19.91 37.19,20.12 35.97,20.12 34.75,18.9 34.14,18.9 JP11.2
N$2  (via drill 0.25)
  Top 0.254: v16.05,17.68 17.07,17.68 RN2.7 | v15.85,10.36 14.02,10.36 D5.A 13.82,10.36 12.19,10.36 JP14.1
  Bottom 0.254: v16.05,17.68 16.26,17.48 16.26,16.66 15.65,16.05 15.65,10.57 v15.85,10.36
N$4
  Top 0.254: RN2.6 17.07,18.49 15.65,18.49 14.83,17.68 14.02,17.68 D2.A
N$5  (via drill 0.25)
  Top 0.254: v5.89,33.73 7.11,33.73 S2.2 | U2.1 7.52,28.04 v6.1,28.04 6.1,26.21 6.3,26.01 7.52,26.01 U2.3
  Bottom 0.254: v5.89,33.73 6.1,33.53 v6.1,28.04
N$7  (via drill 0.25)
  Top 0.254: v15.44,16.87 17.07,16.87 RN2.8 | v15.04,4.67 15.04,3.66 14.02,3.66 D6.A 13.82,3.66 12.19,3.66 JP13.1
  Bottom 0.254: v15.44,16.87 15.04,16.46 v15.04,4.67
N$8  (via drill 0.25)
  Top 0.254: v14.43,18.9 14.02,19.3 10.36,19.3 9.55,20.12 8.13,20.12 6.5,21.74 4.27,21.74 D4.C | v14.22,5.69 14.02,5.89 10.57,5.89 9.96,5.28 9.96,3.45 R9.2
  Bottom 0.254: v14.43,18.9 14.43,5.89 v14.22,5.69
N$9
  Top 0.254: S2.3 7.11,31.29 6.1,31.29 4.67,29.87 4.67,28.04 F1.2
N$10  (via drill 0.25)
  Top 0.254: v31.09,26.82 29.87,26.82 U3.7 | v30.89,21.54 31.09,21.34 32.51,21.34 Y1.3
  Bottom 0.254: v31.09,26.82 30.89,26.62 v30.89,21.54
N$11
  Top 0.254: U1.5 2.03,17.07 2.03,13.82 R5.1
N$12  (via drill 0.25)
  Top 0.254: v34.14,25.81 33.33,25.81 31.5,27.64 29.87,27.64 U3.8 | v34.14,23.77 32.51,23.77 Y1.1
  Bottom 0.254: v34.14,23.77 v34.14,25.81
N$14  (via drill 0.25)
  Top 0.254: v7.32,15.44 6.3,15.44 4.67,17.07 U1.1 | v7.92,5.28 8.13,5.08 8.13,3.45 R9.1
  Bottom 0.254: v7.32,15.44 7.92,14.83 7.92,13.61 7.72,13.41 7.72,6.71 7.92,6.5 v7.92,5.28
N$15  (via drill 0.25)
  Top 0.254: v7.92,32.51 8.94,32.51 RN1.7 | v7.92,24.79 9.96,24.79 10.77,23.98 12.19,23.98 | 12.19,23.98 13.82,23.98 D9.A | 12.19,23.98 JP17.1
  Bottom 0.254: v7.92,24.79 v7.92,32.51
N$16  (via drill 0.25)
  Top 0.254: v8.74,34.95 8.13,34.34 8.13,33.53 8.53,33.12 8.94,33.12 RN1.6 | v8.74,30.48 11.58,30.48 11.79,30.68 12.45,30.68 | 12.45,30.68 12.65,30.68 12.6,30.48 13.82,30.48 D8.A | 12.45,30.68 JP12.1
  Bottom 0.254: v8.74,30.48 v8.74,34.95
N$17
  Top 0.254: RN1.5 9.14,34.14 10.36,35.36 11.99,35.36 JP10.1 12.19,35.36 12.39,35.36 12.8,35.76 13.41,35.76 13.82,36.17 D7.A
N$18
  Top 0.254: LED1.A 30.48,36.17 32.92,36.17 33.12,35.97 33.12,35.15 R7.1
N$19
  Top 0.254: Q1.1 43.89,36.78 42.06,34.95 41.86,34.95 41.86,35.15 R6.2
N$20  (via drill 0.25)
  Top 0.254: v40.97,33.58 44.35,33.5 46.18,33.5 46.33,35.56 Q1.3 | v33.33,33.53 33.12,33.33 32.51,33.33 31.9,33.93 30.48,33.93 LED1.C
  Bottom 0.254: v40.97,33.58 38.61,34.54 34.14,34.54 33.33,33.73 v33.33,33.53
N$21  (via drill 0.25)
  Top 0.254: v34.95,26.42 34.54,26.82 34.54,28.04 34.14,28.45 33.12,28.45 32.92,28.25 R8.1 | v42.27,24.59 42.47,24.79 44.3,24.79 C5.2
  Bottom 0.254: v34.95,26.42 35.36,26.42 38,23.77 41.45,23.77 v42.27,24.59
N$22  (via drill 0.25)
  Top 0.254: v34.75,29.06 36.17,30.48 R10.1 | v40.03,25.81 v38,25.81 | v41.25,24.59 42.47,25.81 43.08,25.81 43.69,26.42 44.91,26.42 46.33,24.99 46.33,24.79 46.53,24.79 C7.2
  Bottom 0.254: v38,25.81 v34.75,29.06 | v41.25,24.59 v40.03,25.81
N$23
  Top 0.254: USB1.3 5.49,7.72 5.49,8.13 USB1.2
OUT+  (via drill 0.25)
  Top 0.254: v46.33,28.65 44.3,28.65 44.09,28.45 U4.5 | v48.62,27.64 48.36,27.64 53.44,32.72 60.15,32.72 60.55,33.12 62.38,33.12 86.56,8.94 86.56,6.3 v86.36,6.1 | v86.36,4.06 86.36,2.64 85.14,1.42 JP9.1
  Bottom 0.254: v48.62,27.64 v46.33,28.65 | v86.36,4.06 v86.36,6.1
OUT-  (via drill 0.25)
  Top 0.254: v46.51,31.5 44.09,30.48 U4.8 | v49.17,29.46 49.17,29.67 52.83,33.33 59.94,33.33 60.35,33.73 62.59,33.73 87.17,9.14 87.17,5.89 JP9.2
  Bottom 0.254: v49.17,29.46 v46.51,31.5
RST  (via drill 0.25)
  Top 0.254: 10.16,14.22 10.16,12.6 R4.1 | 10.16,14.22 10.16,17.88 9.35,18.69 8.33,18.69 C3.2 | v27.23,19.1 26.42,19.1 25.81,19.71 25.81,20.52 U3.29 | 10.16,14.22 16.46,14.22 18.29,16.05 19.3,16.05 19.51,16.26 v21.13,16.26 | v22.15,15.24 22.15,15.44 23.77,17.07 27.03,17.07 v27.23,16.87
  Bottom 0.254: JP4.5 27.23,32.31 v27.23,19.1 v27.23,16.87 | v22.15,15.24 v21.13,16.26
RXI  (via drill 0.25)
  Top 0.254: v26.21,21.95 26.62,21.54 26.62,20.73 U3.30 | v26.21,9.35 18.69,9.35 JP1.4
  Bottom 0.254: v26.21,9.35 v26.21,21.95
SCK  (via drill 0.25)
  Top 0.254: v22.35,27.43 21.95,27.43 21.74,27.64 21.13,27.64 U3.17
  Bottom 0.254: v22.35,27.43 22.35,30.68 23.7,30.63 23.7,30.84 23.65,32.31 24.59,32.31 JP4.3
SDN*
  Top 0.254: U4.1 40.84,30.68 40.84,31.29 40.03,32.11 40.03,35.15 R6.1 39.83,35.36 40.03,35.56 40.03,35.76 39.83,35.76 38.41,34.34 37.59,34.34 R3.1
TXO
  Top 0.254: U3.31 27.43,20.52 27.43,19.91 28.04,19.3 28.04,17.68 23.57,17.68 20.32,14.43 20.32,11.99 18.69,11.99 JP1.5
USB_VIN  (via drill 0.25)
  Top 0.254: D4.A 2.03,21.74 0.61,21.74 0.61,19.1 0.81,18.9 1.83,18.9 U1.4 2.03,18.9 3.05,18.9 v3.25,19.1 | v4.06,23.16 8.53,23.16 C9.1 | v6.91,8.94 5.49,8.94 USB1.1 | v6.43,3.45 4.27,3.45 3.05,2.23 3.05,1.63 1.83,1.63 JP6.2 | v3.25,15.44 5.49,15.44 v7.11,13.82
  Bottom 0.254: v4.06,23.16 3.99,22.96 3.99,19.71 v3.25,19.1 v3.25,15.44 | v6.43,3.45 6.3,8.33 v6.91,8.94 7.11,9.14 v7.11,13.82
VBATT  (via drill 0.7)  (1 unrouted)
  Top 0.254: 17.45,3.05 19.36,3.05
  Top 0.406: v3.05,20.32 3.25,20.32 4.47,19.1 U1.3 5.56,19.02 v5.94,19.41 | v2.79,23.16 2.44,23.16 2.23,23.37 2.23,24.59 C10.1 2.23,24.79 2.23,26.21 2.03,26.42 1.83,26.42 1.83,27.84 F1.1 | v77.52,7.92 80.06,7.92 JP7.2 | v75.79,9.4 75.54,8.99 74.47,7.92 v65.53,7.92 | v60.15,5.08 60.15,5.28 59.74,5.69 40.84,5.69 40.44,5.28 40.03,5.28 39.01,6.3 26.57,6.3 25.6,6.1 v22.45,6.1 | v22.45,2.9 19.84,3.02 19.36,3.05 | 17.45,3.05 17.3,2.52 13.16,2.52 12.6,1.83 6.71,1.83 v6.1,2.18
  Bottom 0.356: 62.81,8.13 64.47,8.13
  Bottom 0.406: v2.79,23.16 3.17,23.16 3.17,22.35 3.05,22.35 3.05,23.11 | 3.05,22.99 v3.05,20.32 | v75.79,9.4 v77.52,7.92 | v65.53,7.92 65.08,7.98 64.87,7.98 64.47,8.13 | v60.15,5.08 62.81,8.13 | v22.45,2.9 v22.45,6.1 | v6.1,2.18 6.1,2.64 5.49,3.25 5.49,3.66 5.69,3.86 v5.94,19.41
VCC  (via drill 0.25)
  Top 0.381: 30.89,24.99 30.48,24.59 29.87,24.59 U3.4 | 30.89,24.99 30.89,25.6 30.48,26.01 29.87,26.01 U3.6 | 30.89,24.99 34.14,24.99 34.54,24.59 | 34.54,24.59 34.95,24.18 35.76,24.18 C8.1 35.97,24.18 37.8,24.18 38,23.98 38,22.96 C4.1 38.2,22.76 40.84,25.4 41.25,25.4 42.27,26.42 42.88,26.42 v43.69,27.23 | JP7.3 80.06,10.36 78.23,10.36 69.7,1.83 63.8,1.83 JP5.6 62.59,0.61 43.89,0.61 | 8.33,8.13 8.33,10.36 8.13,10.57 8.13,12.39 R4.2 8.13,12.6 8.13,15.44 8.74,15.44 v8.94,15.65 | 8.33,8.13 8.33,6.5 16.26,6.5 16.66,6.91 18.49,6.91 JP1.3 18.69,6.91 19.91,6.91 26.21,0.61 43.89,0.61 | 8.33,8.13 C2.1 | 34.95,36.17 34.95,35.15 R7.2 35.15,34.95 34.95,34.75 34.95,33.73 37.8,30.89 37.8,27.84 34.54,24.59 | 34.95,36.17 37.39,36.17 R3.2 | 34.95,36.17 34.95,37.59 23.98,37.59 22.96,36.58 22.96,34.95 22.35,34.95 JP4.2 22.15,34.95 20.32,34.95 20.32,33.53 17.88,31.09 C1.A 17.88,30.89 17.88,27.03 | v8.94,27.64 9.35,28.04 10.16,28.04 U2.5 10.36,28.04 11.58,28.04 11.58,27.84 12.6,26.82 15.24,26.82 15.44,27.03 17.88,27.03 | 17.88,27.03 19.51,27.03 19.71,26.82 20.93,26.82 U3.18 | v45.52,29.46 45.31,29.26 44.09,29.26 U4.6 | v48.16,8.94 v54.86,15.65 | 43.89,0.61 v48.16,4.88
  Bottom 0.381: v8.94,27.64 v8.94,15.65 | v45.52,29.46 45.52,27.84 45.72,27.64 45.72,26.82 45.31,26.42 44.5,26.42 v43.69,27.23 | v54.86,15.65 54.86,17.48 54.46,17.88 54.46,19.3 JP3.1 | v48.16,4.88 v48.16,8.94

### Text on the board
tPlace: googleShoes | v01 | /Users/jmsaavedra/Desktop/yyn.BMP | DTR | TX0 | FSR | FSR | RX1 | SCL | VBat | 3V3 | SDA | GND | GND | GND | CTS | GND | GND | GND | GND | - | + | GND | 3V3 | spkr
bPlace: BLK | GND | AREF | FTDI | 3V3 | RXI | 5V | - | TXO | CHG | GRN | DTR